# EAGLE design Drivers (EAGLE 7.7.0)
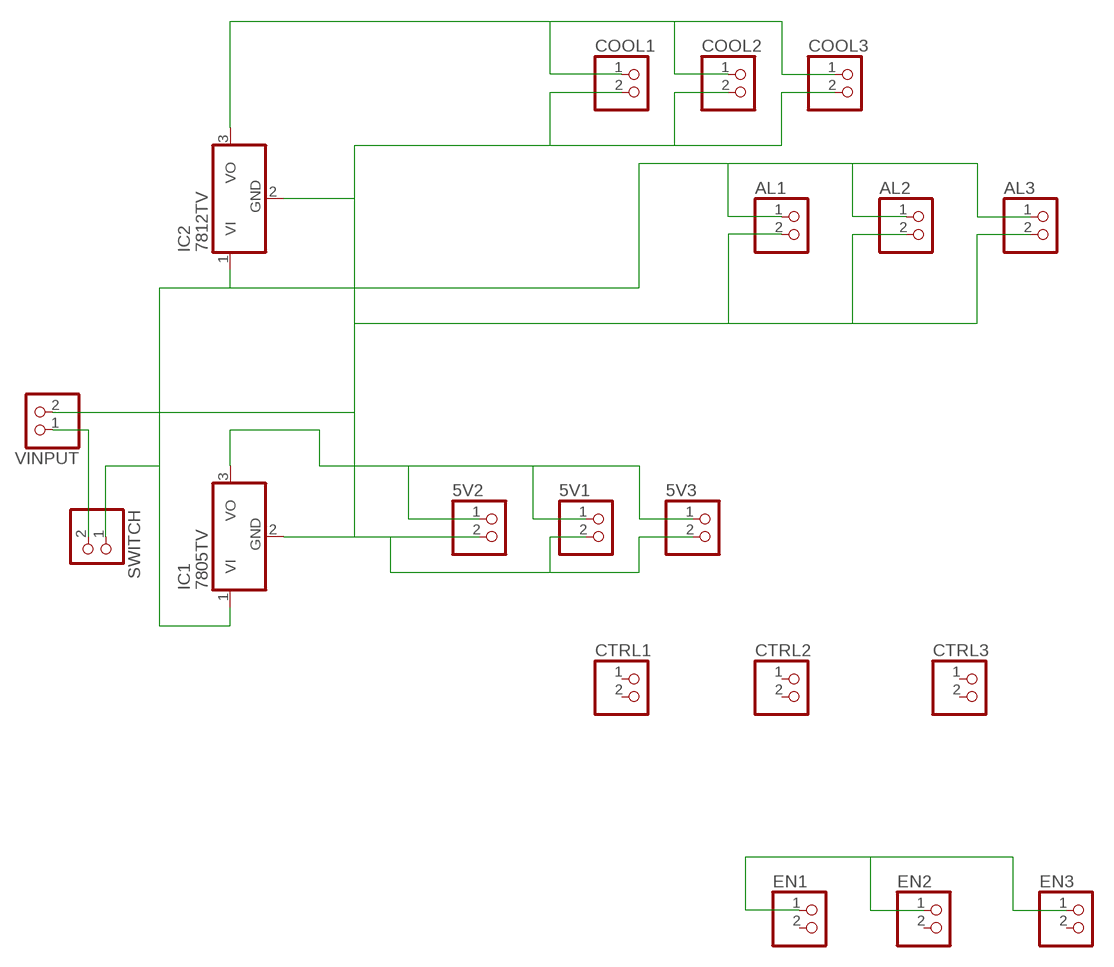
[diagram p0: schematic, sheet 1]

## Parts
5V1  PINHD-1X2  [1X02]
5V2  PINHD-1X2  [1X02]
5V3  PINHD-1X2  [1X02]
AL1  PINHD-1X2  [1X02]
AL2  PINHD-1X2  [1X02]
AL3  PINHD-1X2  [1X02]
COOL1  PINHD-1X2  [1X02]
COOL2  PINHD-1X2  [1X02]
COOL3  PINHD-1X2  [1X02]
CTRL1  PINHD-1X2  [1X02]
CTRL2  PINHD-1X2  [1X02]
CTRL3  PINHD-1X2  [1X02]
EN1  PINHD-1X2  [1X02]
EN2  PINHD-1X2  [1X02]
EN3  PINHD-1X2  [1X02]
IC1  7805TV  [TO220V]
IC2  7812TV  [TO220V]
SWITCH  PINHD-1X2  [1X02]
VINPUT  PINHD-1X2  [1X02]

## Nets
N$1: 5V1.2 5V2.2 5V3.2 AL1.2 AL2.2 AL3.2 COOL1.2 COOL2.2 COOL3.2 IC1.2(GND) IC2.2(GND) VINPUT.2
N$2: 5V1.1 5V2.1 5V3.1 IC1.3(VO)
N$9: EN1.1 EN2.1 EN3.1
N$10: AL1.1 AL2.1 AL3.1 IC1.1(VI) IC2.1(VI) SWITCH.1
N$11: SWITCH.2 VINPUT.1
N$12: COOL1.1 COOL2.1 COOL3.1 IC2.3(VO)
Unconnected: CTRL1.1 CTRL1.2 CTRL2.1 CTRL2.2 CTRL3.1 CTRL3.2 EN1.2 EN2.2 EN3.2

## Library data of the parts
5V1-5V3 AL1-AL3 COOL1-COOL3 CTRL1-CTRL3 EN1-EN3 SWITCH VINPUT = pinhead:PINHD-1X2: PIN HEADER
IC1 IC2 = linear:78*: Positive VOLTAGE REGULATOR Source: http://cache.national.com/ds/LM/LM78L05.pdf http://www.fairchildsemi.com/ds/LM/LM7805.pdf

## Net classes
0 default: width 1.016 mm, drill 1.016 mm, clearance 1.016 mm

## Board
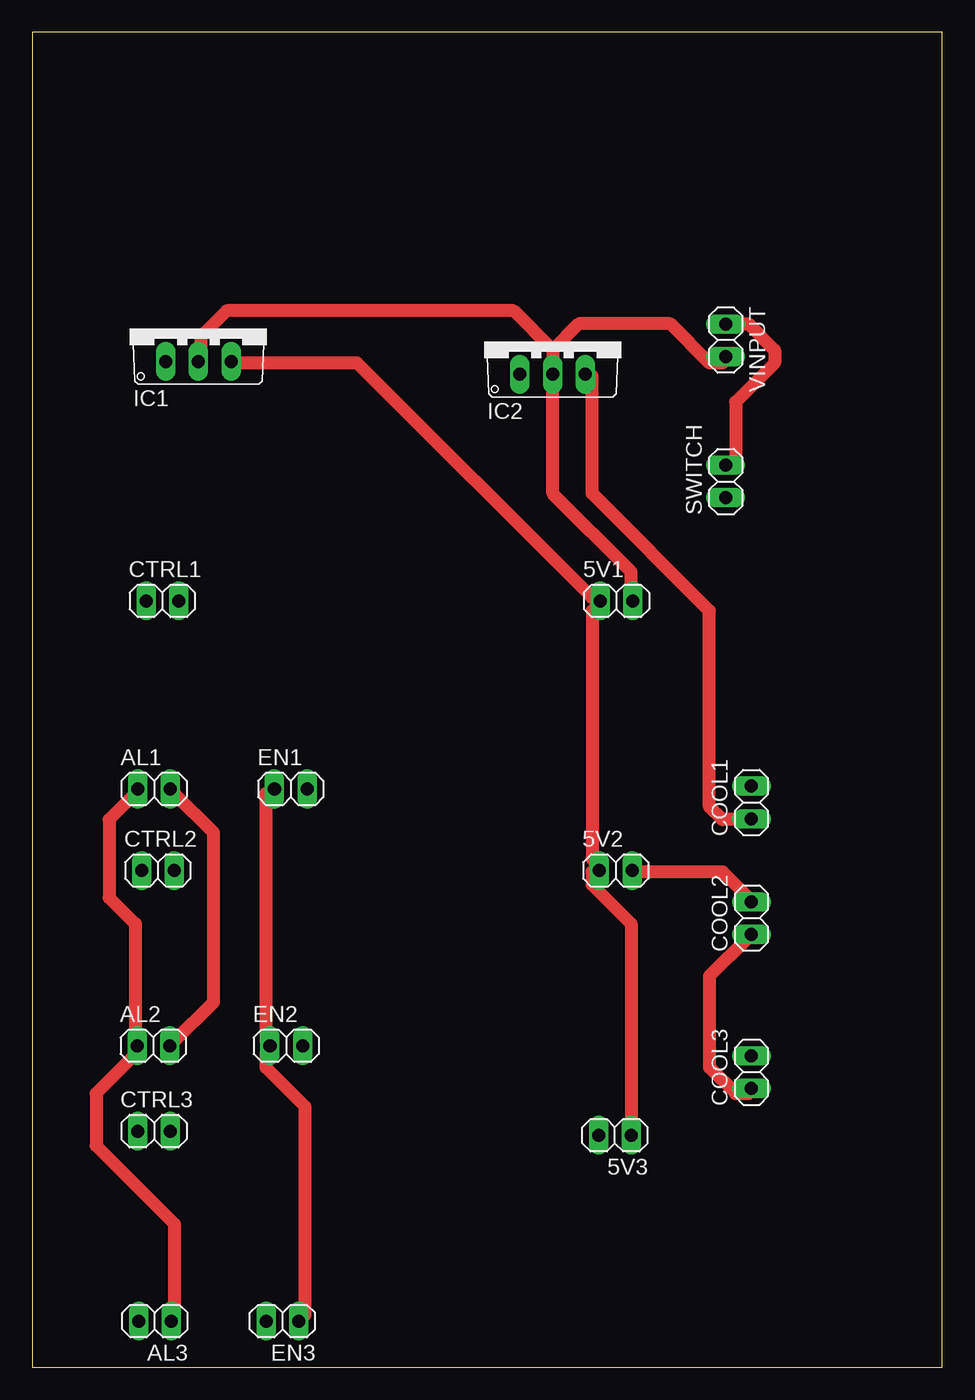
[diagram p1: board, top side]
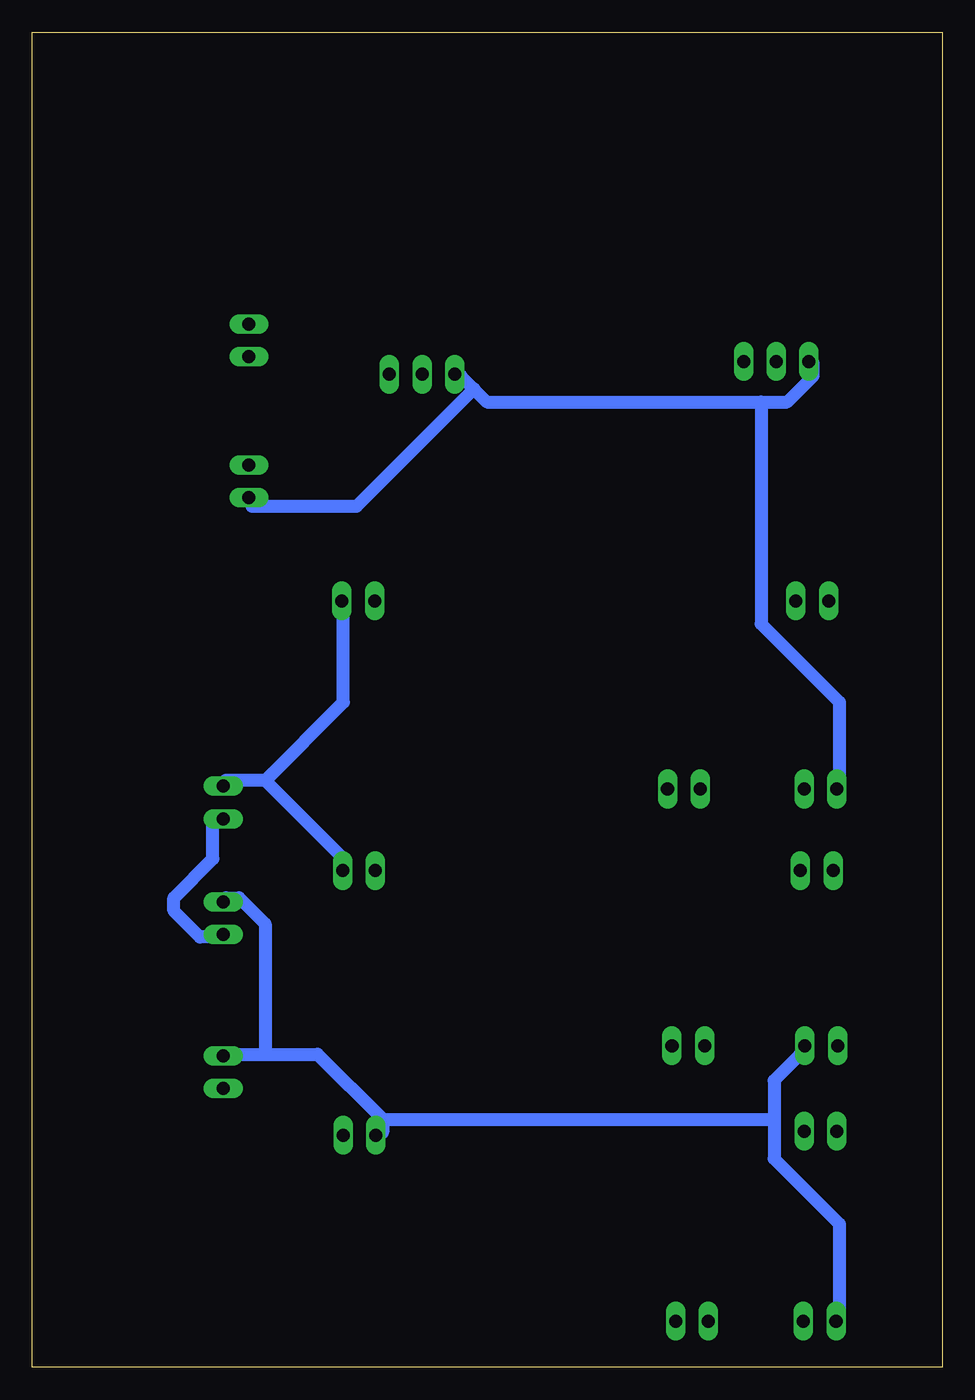
[diagram p2: board, bottom side, seen from below]

Size 70.88 x 104 mm. Coordinates in mm from the lower left corner, seen from the top.
Outline: 0,0 70.88,0 70.88,104 0,104 0,0
Copper layers (1*16): Top 0.035mm / dielectric 1.5mm / Bottom 0.035mm
Design rules "default": minimum track width 10mil, minimum drill 24mil, track to track 8mil, track to pad 8mil, pad to pad 8mil, via to via 8mil, smd to smd 8mil, copper to edge 40mil, drill to drill 8mil, minimum pad ring 10mil, minimum via ring 8mil, stop-mask expansion 4mil, vias tented up to drill 0mil, thermal gap 10mil

### Footprints (pad centres in the part's own frame; a part is rotated, then mirrored left to right if it is on the bottom)
1X02 = drill 1.016 long: 1 -1.27,0; 2 1.27,0
TO220V = drill 1.016 long: 1 -2.54,-2.54; 2 0,-2.54; 3 2.54,-2.54

### Placement (x,y rotation side)
5V1  45.49,59.7 0 top
5V2  45.44,38.7 0 top
5V3  45.38,18.08 180 top
AL1  9.49,45.05 0 top
AL2  9.44,25.05 0 top
AL3  9.56,3.6 180 top
COOL1  56,44 90 top
COOL2  56,35 90 top
COOL3  56,23 90 top
CTRL1  10.14,59.7 0 top
CTRL2  9.79,38.7 0 top
CTRL3  9.49,18.4 0 top
EN1  20.14,45.05 0 top
EN2  19.79,25.05 0 top
EN3  19.49,3.6 180 top
IC1  12.95,80.89 0 top
IC2  40.52,79.89 0 top
SWITCH  54,69 90 top
VINPUT  54,80 270 top

### Tracks (layer width: path | path; a pad name or v marks a point on that pad's centre or on a via)
N$1
  Top 1.016: AL1.2 11.08,44.7 14.13,41.66 14.13,28.45 11.08,25.4 AL2.2 | 40.54,79.25 40.54,78.23 IC2.2 40.54,77.22 40.54,68.07 46.64,61.98 46.64,59.94 5V1.2 | 40.54,79.25 42.58,81.28 49.69,81.28 52.74,78.23 53.75,78.23 VINPUT.2 | 40.54,79.25 37.5,82.3 15.14,82.3 13.11,80.26 13.11,79.25 IC1.2 | 5V2.2 46.64,38.61 53.75,38.61 55.78,36.58 COOL2.2
  Bottom 1.016: 13.11,19.3 13.11,22.35 11.08,24.38 AL2.2 | 13.11,19.3 13.11,16.26 8.03,11.18 8.03,4.06 AL3.2 | 43.59,19.3 43.59,18.29 5V3.2 43.59,19.3 | 43.59,19.3 48.67,24.38 52.74,24.38 | 52.74,24.38 55.78,24.38 COOL3.2 | 52.74,45.72 55.78,45.72 COOL1.2 | 52.74,45.72 46.64,39.62 5V2.2 | 52.74,45.72 46.64,51.82 46.64,58.93 5V1.2 | 52.74,24.38 52.74,34.54 54.77,36.58 55.78,36.58 COOL2.2 | 43.59,19.3 13.11,19.3
N$2
  Top 1.016: IC1.3 16.16,78.23 25.3,78.23 43.59,59.94 5V1.1 43.59,58.93 43.59,39.62 5V2.1 43.59,38.61 43.59,37.59 46.64,34.54 46.64,18.29 5V3.1
N$9
  Top 1.016: EN1.1 18.19,44.7 18.19,25.4 EN2.1 18.19,24.38 18.19,23.37 21.24,20.32 21.24,4.06 EN3.1
N$10
  Top 1.016: AL1.1 8.03,44.7 6,42.67 6,36.58 8.03,34.54 8.03,25.4 AL2.1 8.03,24.38 4.98,21.34 4.98,17.27 11.08,11.18 11.08,4.06 AL3.1
  Bottom 1.016: 14.13,75.18 35.46,75.18 36.48,76.2 | 14.13,75.18 12.1,75.18 10.06,77.22 10.06,78.23 IC1.1 | 36.48,76.2 37.5,77.22 IC2.1 | 36.48,76.2 45.62,67.06 53.75,67.06 SWITCH.1 | 14.13,75.18 14.13,57.91 8.03,51.82 8.03,45.72 AL1.1
N$11
  Top 1.016: SWITCH.2 54.77,70.1 54.77,75.18 57.82,78.23 57.82,79.25 55.78,81.28 54.77,81.28 VINPUT.1
N$12
  Top 1.016: COOL3.1 55.78,21.34 54.77,21.34 52.74,23.37 52.74,30.48 55.78,33.53 COOL2.1 | IC2.3 43.59,77.22 43.59,68.07 52.74,58.93 52.74,43.69 53.75,42.67 55.78,42.67 COOL1.1
  Bottom 1.016: COOL1.1 56.8,42.67 56.8,39.62 59.85,36.58 59.85,35.56 57.82,33.53 56.8,33.53 COOL2.1